# Altium schematic sheet 05_SD_USB.SchDoc
size A4; PageSetup: Record=PageOptions|CenterHorizontal=True|CenterVertical=True|PrintScale=0.97|XCorrection=1.00|YCorrection=1.00|PrintKind=0|BorderSize=5000000|LeftOffset=0|BottomOffset=0|Orientation=2|PaperLength=1000|PaperWidth=1000|Scale=100|PaperSource=7|PrintQuality=-4|MediaType=1|DitherType=10|PaperKind=A4|PrintScaleMode=1
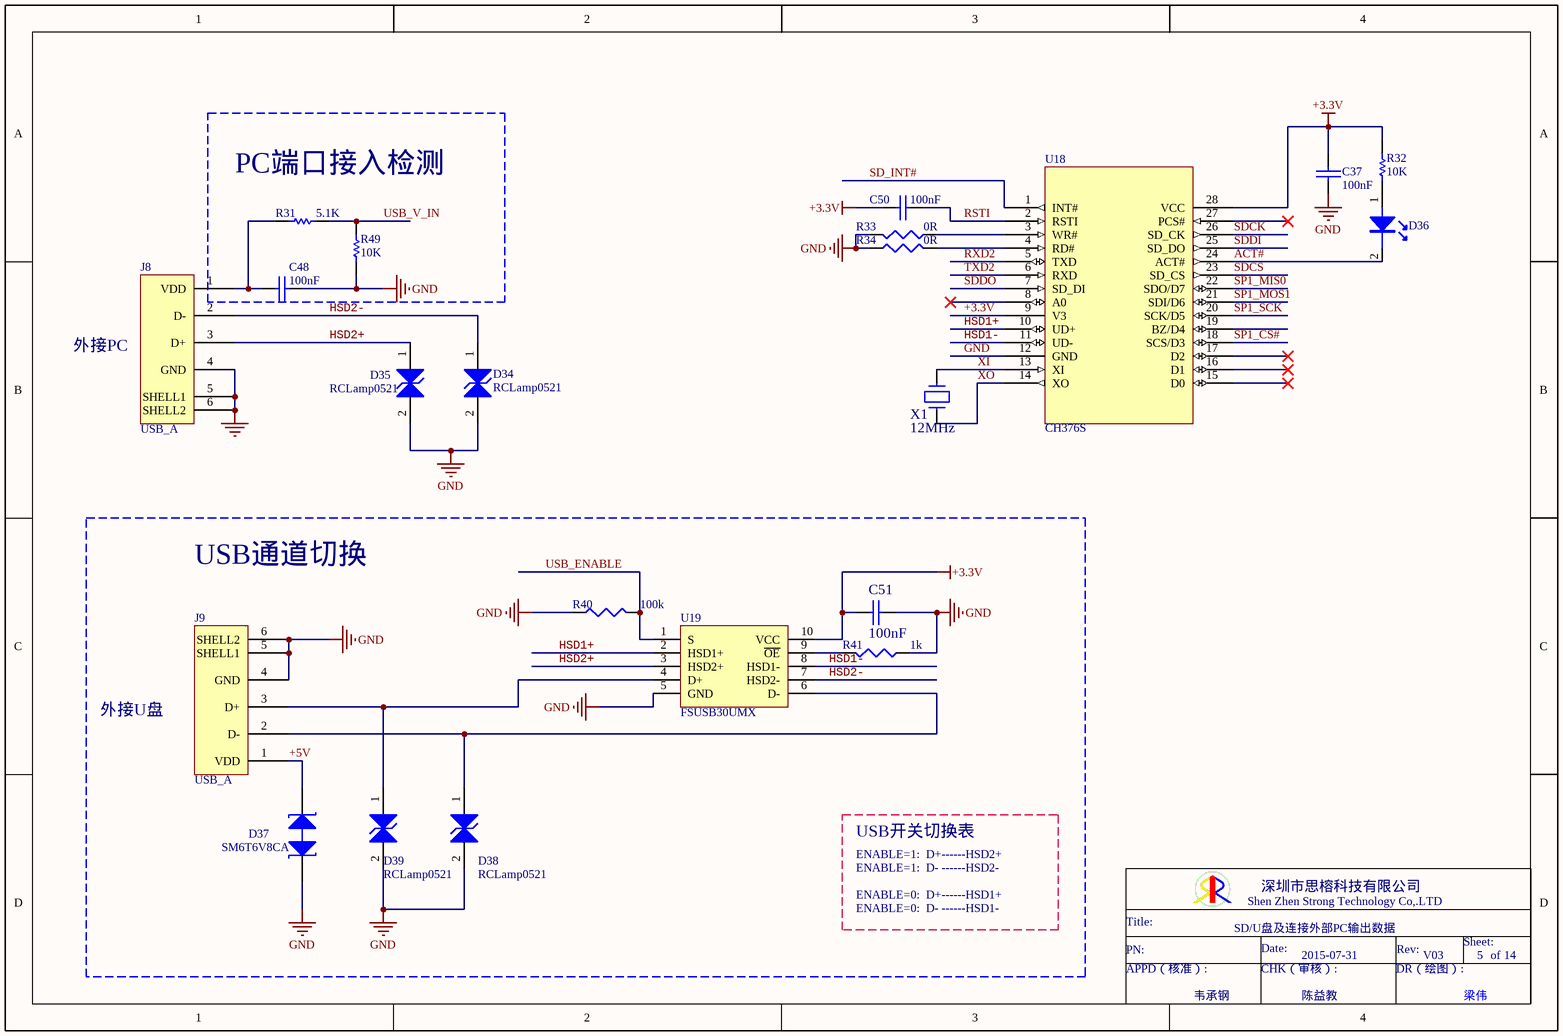
[diagram p0: 05_SD_USB.SchDoc]

## Parts
C37  100nF  [0603C]
C48  100nF  [0603C]
C50  100nF  [0603C]
C51  100nF  [0603C]
D34  RCLamp0521  [TVS]
D35  RCLamp0521  [TVS]
D36  LED灯 白发红光  [D0603]  (value not drawn)
D37  SM6T6V8CA  [DO-214AA]
D38  RCLamp0521  [TVS]
D39  RCLamp0521  [TVS]
J8  USB_A  [USB-AF]
J9  USB_A  [USB-AF]
R31  5.1K  [0603R]
R32  10K  [0603R]
R33  0R  [0603R]
R34  0R  [0603R]
R40  100k  [0603R]
R41  1k  [0603R]
R49  10K  [0603R]
U18  CH376S  [SOP28]
U19  FSUSB30UMX  [SSOP10]
X1  12MHz  [CRYL3*5]

## Blocks framed on the sheet
PC端口接入检测: C48 R31 R49
USB通道切换: C51 D37-D39 J9 R40 R41 U19

## Nets
+3.3V: C37.1 C50.1 C51.1 R32.2 U18.9(V3) U18.28(VCC) U19.10(VCC)
GND: C37.2 C48.2 C51.2 D34.2 D35.2 D37.1 D38.2 D39.2 J8.4(GND) J8.5(SHELL1) J8.6(SHELL2) J9.4(GND) J9.5(SHELL1) J9.6(SHELL2) R33.2 R34.1 R40.1 R41.1 R49.2 U18.12(GND) U19.5(GND)
+5V: D37.2 J9.1(VDD)
ACT#: D36.2 U18.24(ACT#)
HSD1+: U18.10(UD+) U19.2(HSD1+)
HSD1-: U18.11(UD-) U19.8(HSD1-)
HSD2+: D35.1 J8.3(D+) U19.3(HSD2+)
HSD2-: D34.1 J8.2(D-) U19.7(HSD2-)
RSTI: C50.2 U18.2(RSTI)
RXD2: U18.5(TXD)
SD_INT#: U18.1(INT#)
SDCK: U18.26(SD_CK)
SDCS: U18.23(SD_CS)
SDDI: U18.25(SD_DO)
SDDO: U18.7(SD_DI)
SP1_CS#: U18.18(SCS/D3)
SP1_MIS0: U18.22(SDO/D7)
SP1_MOS1: U18.21(SDI/D6)
SP1_SCK: U18.20(SCK/D5)
TXD2: U18.6(RXD)
USB_ENABLE: R40.2 U19.1(S)
USB_V_IN: R31.2 R49.1
XI: U18.13(XI) X1.1
XO: U18.14(XO) X1.2
NetC48_1: C48.1 J8.1(VDD) R31.1
NetD36_1: D36.1 R32.1
NetD38_1: D38.1 J9.2(D-) U19.6(D-)
NetD39_1: D39.1 J9.3(D+) U19.4(D+)
NetR33_1: R33.1 U18.3(WR#)
NetR34_2: R34.2 U18.4(RD#)
NetR41_2: R41.2 U19.9(~{OE})

Not connected (* = marked no-connect by the designer): U18 8(A0)* 15(D0)* 16(D1)* 17(D2)* 19(BZ/D4) 27(PCS#)*

## Notes on the sheet
- 外接PC
- 外接U盘
- USB开关切换表
- ENABLE=1:  D+------HSD2+
- ENABLE=1:  D- ------HSD2-
- ENABLE=0:  D+------HSD1+
- ENABLE=0:  D- ------HSD1-
- SD/U盘及连接外部PC输出数据
- 2015-07-31
- V03
- 5
- 14
- 韦承钢
- 陈益教
- Shen Zhen Strong Technology Co,.LTD
- 深圳市思榕科技有限公司
- Title:
- PN:
- APPD（核准）:
- Date:
- CHK（审核）:
- DR（绘图）:
- Rev:
- Sheet:
- of
- 梁伟

## Library data of the parts
C37 C48 C50 = CAP: Capacitor
C51 = Pro7B.tmp_0.01u_17
D34 D35 D38 D39 = TVS: RCLamp0521   SEMTECH; Published: 8-Jun-2000; LatestRevisionDate: 29-May-2009; LatestRevisionNote: IPC-7351 Footprint Added.; PackageVersion: Aug-1999; PackageReference: SOT-23B; Publisher: Altium Limited; PackageDescription: 3-Pin SOT-23 Package 0.95 mm Pitch, 2.4 mm Lead Span
D36 = LED: LED灯
D37 = TVS-1: SM6T6V8CA  ST; Published: 8-Jun-2000; LatestRevisionDate: 29-May-2009; LatestRevisionNote: IPC-7351 Footprint Added.; PackageVersion: Aug-1999; PackageReference: SOT-23B; Publisher: Altium Limited; PackageDescription: 3-Pin SOT-23 Package 0.95 mm Pitch, 2.4 mm Lead Span
J8 J9 = USB
R31 R32 R49 = RES
R33 = RES1: R1219: 0
R34 = RES1: R511: 0
R40 R41 = RES1
U18 = CH376S: USB Host and SD card Host with File System & USB Device for MCU, parallel / SPI / UART Serial
U19 = FSUSB30UMX_1: USB开关
X1 = Pro7B.tmp_12MHz_19